# Altium schematic sheet power_POS5V.schdoc: POS5V.schdoc
size A4; Organization: Badgerloop; Address1: 133 Engineering Research; Address2: Building; Address3: Madison, WI 53715; DocumentNumber: 1; Revision: A; SheetNumber: 1; SheetTotal: 2
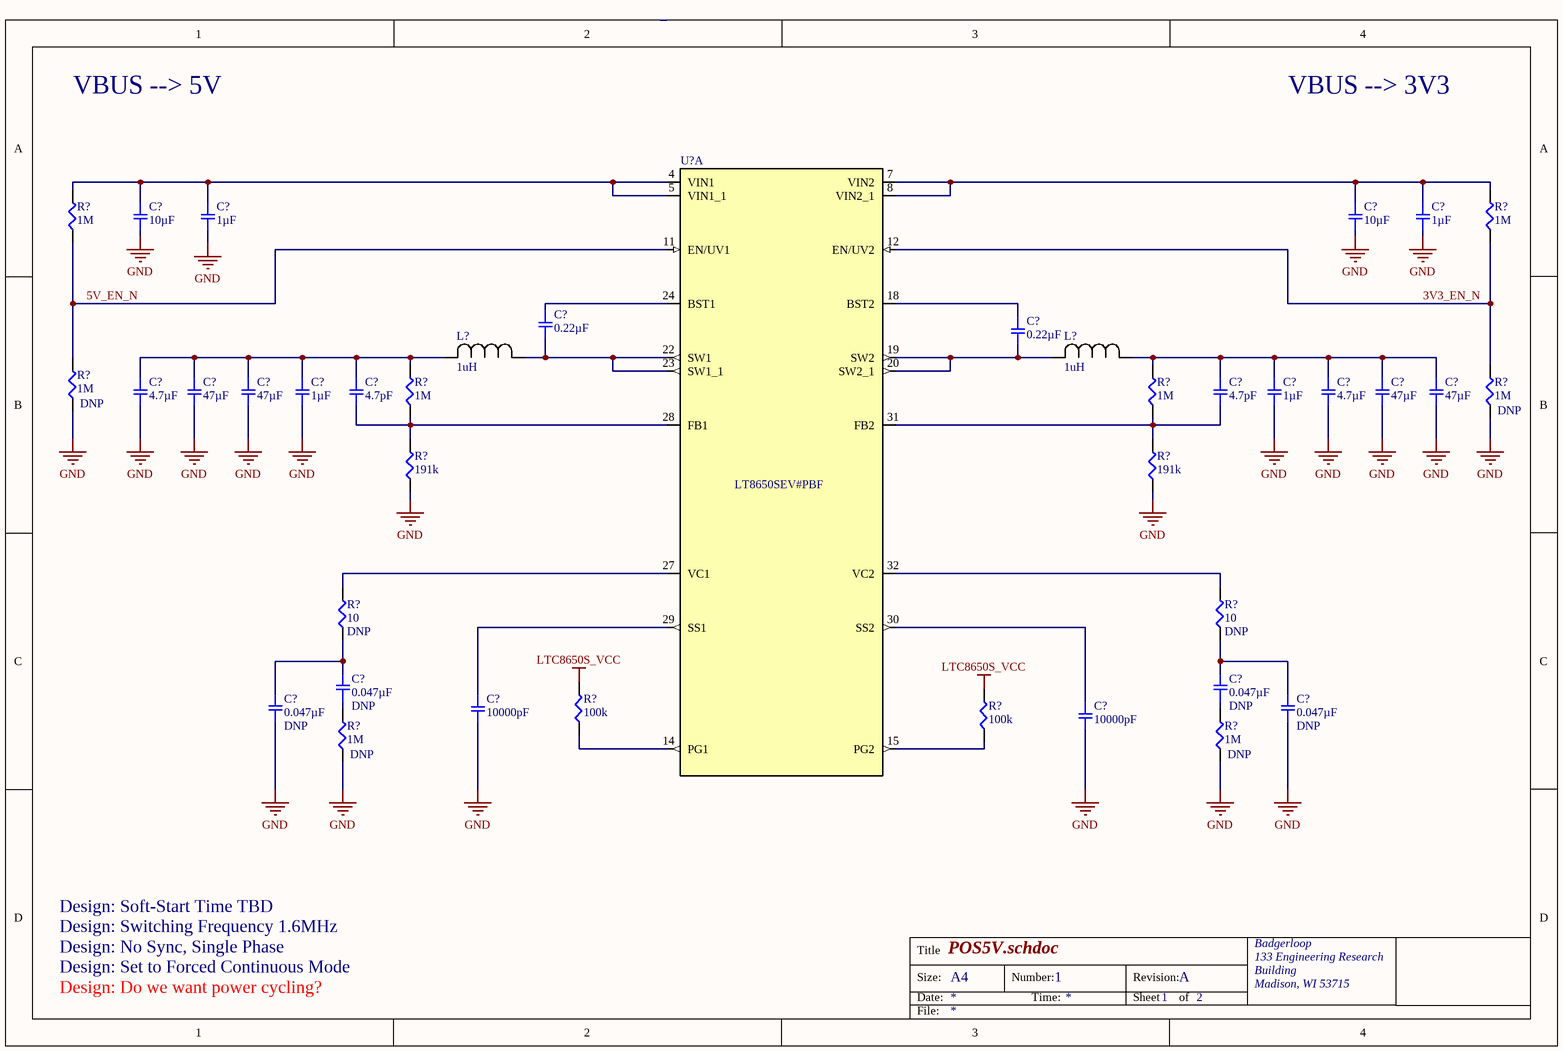
[diagram p0: power_POS5V.schdoc]

## Parts
(Parts that share a designator on the sheet are numbered #1, #2 ... from top to bottom, then left to right.)
C?#1  10µF  [SMD-1206C]
C?#2  1µF  [SMD-0805C]
C?#3  10µF  [SMD-1206C]
C?#4  1µF  [SMD-0805C]
C?#5  0.22µF  [SMD-0603C]
C?#6  0.22µF  [SMD-0603C]
C?#7  4.7µF  [SMD-0603C]
C?#8  47µF  [SMD-1206C]
C?#9  47µF  [SMD-1206C]
C?#10  1µF  [SMD-0603C]
C?#11  4.7pF  [SMD-0603C]
C?#12  4.7pF  [SMD-0603C]
C?#13  1µF  [SMD-0603C]
C?#14  4.7µF  [SMD-0603C]
C?#15  47µF  [SMD-1206C]
C?#16  47µF  [SMD-1206C]
C?#17  0.047µF  Do Not Populate: DNP  [SMD-0402C]
C?#18  0.047µF  Do Not Populate: DNP  [SMD-0402C]
C?#19  0.047µF  Do Not Populate: DNP  [SMD-0402C]
C?#20  10000pF  [SMD-0603C]
C?#21  0.047µF  Do Not Populate: DNP  [SMD-0402C]
C?#22  10000pF  [SMD-0603C]
L?#1  1uH  [IND_TAIYO_CBC201]
L?#2  1uH  [IND_TAIYO_CBC201]
R?#1  1M  [SMD-0402-RES]
R?#2  1M  [SMD-0402-RES]
R?#3  1M  Do Not Populate: DNP  [SMD-0402-RES]
R?#4  1M  [SMD-0402-RES]
R?#5  1M  [SMD-0402-RES]
R?#6  1M  Do Not Populate: DNP  [SMD-0402-RES]
R?#7  191k  [SMD-0402-RES]
R?#8  191k  [SMD-0402-RES]
R?#9  10  Do Not Populate: DNP  [SMD-0402-RES]
R?#10  10  Do Not Populate: DNP  [SMD-0402-RES]
R?#11  100k  [SMD-0402-RES]
R?#12  100k  [SMD-0402-RES]
R?#13  1M  Do Not Populate: DNP  [SMD-0402-RES]
R?#14  1M  Do Not Populate: DNP  [SMD-0402-RES]
U?  LT8650SEV#PBF  [QFN50P600X400X103-32N240X440]  (part A of 2)

## Nets
GND: C?#1.2 C?#2.2 C?#3.2 C?#4.2 C?#7.2 C?#8.2 C?#9.2 C?#10.2 C?#13.2 C?#14.2 C?#15.2 C?#16.2 C?#19.1 C?#20.2 C?#21.1 C?#22.2 R?#3.1 R?#6.1 R?#7.1 R?#8.1 R?#13.1 R?#14.1
LTC8650S_VCC: R?#11.2 R?#12.2
3V3_EN_N: R?#2.1 R?#6.2 U?.12(EN/UV2)
5V_EN_N: R?#1.1 R?#3.2 U?.11(EN/UV1)
NetC?#1_1: C?#1.1 C?#2.1 R?#1.2 U?.4(VIN1) U?.5(VIN1_1)
NetC?#3_1: C?#3.1 C?#4.1 R?#2.2 U?.7(VIN2) U?.8(VIN2_1)
NetC?#5_1: C?#5.1 U?.24(BST1)
NetC?#5_2: C?#5.2 L?#1.1 U?.22(SW1) U?.23(SW1_1)
NetC?#6_1: C?#6.1 U?.18(BST2)
NetC?#6_2: C?#6.2 L?#2.2 U?.19(SW2) U?.20(SW2_1)
NetC?#7_1: C?#7.1 C?#8.1 C?#9.1 C?#10.1 C?#11.1 L?#1.2 R?#4.2
NetC?#11_2: C?#11.2 R?#4.1 R?#7.2 U?.28(FB1)
NetC?#12_1: C?#12.1 C?#13.1 C?#14.1 C?#15.1 C?#16.1 L?#2.1 R?#5.2
NetC?#12_2: C?#12.2 R?#5.1 R?#8.2 U?.31(FB2)
NetC?#17_1: C?#17.1 R?#13.2
NetC?#17_2: C?#17.2 C?#19.2 R?#9.1
NetC?#18_1: C?#18.1 R?#14.2
NetC?#18_2: C?#18.2 C?#21.2 R?#10.1
NetC?#20_1: C?#20.1 U?.29(SS1)
NetC?#22_1: C?#22.1 U?.30(SS2)
NetR?#9_2: R?#9.2 U?.27(VC1)
NetR?#10_2: R?#10.2 U?.32(VC2)
NetR?#11_1: R?#11.1 U?.14(PG1)
NetR?#12_1: R?#12.1 U?.15(PG2)

## Notes on the sheet
- VBUS --> 5V
- VBUS --> 3V3
- Design: Soft-Start Time TBD
- Design: Switching Frequency 1.6MHz
- Design: No Sync, Single Phase
- Design: Set to Forced Continuous Mode
- Design: Do we want power cycling?
- Title
- Size:
- Date:
- A4
- Number:
- Time:
- Revision:
- Sheet
- of
- File:

## Library data of the parts
C?#1 C?#3 = GRM31CR61H106KA12L: CAP CER 10UF 50V X5R 1206; Manufacturer: Murata Electronics North America; Factory Stock: 0; Unit Price (USD): 0.65; Minimum Quantity: 1; Tolerance: ±10%; Datasheets: http://www.murata.com/~/media/webrenewal/support/library/catalog/products/capacitor/mlcc/c02e.pdf; Image: //media.digikey.com/Renders/Murata%20Renders/GR331BD72E473KW01L.jpg; Digi-Key Part Number: 490-5961-1-ND; Part Number: GRM31CR61H106KA12L; Quantity Available: 86736; @ qty: 0; Packaging: Cut Tape (CT); Series: GRM; Part Status: Active; Value: 10µF; Voltage: 50V; Temperature Coefficient: X5R; Operating Temperature: -55°C ~ 85°C; Features: -; Ratings: -; Applications: General Purpose; Mounting Type: Surface Mount, MLCC; Package / Case: 1206 (3216 Metric); Size / Dimension: 0.126" L x 0.063" W (3.20mm x 1.60mm); Height - Seated (Max): -; Thickness (Max): 0.071" (1.80mm); Lead Spacing: -; Lead Style: -
C?#2 C?#4 = GCJ21BR71H105KA01L: CAP CER 1UF 50V X7R 0805; Manufacturer: Murata Electronics North America; Factory Stock: 0; Unit Price (USD): 0.33; Minimum Quantity: 1; Tolerance: ±10%; Datasheets: http://www.murata.com/~/media/webrenewal/support/library/catalog/products/capacitor/mlcc/c03e.ashx; Image: //media.digikey.com/Renders/Murata%20Renders/0805%20(2012%20Metric)%20.85mm.jpg; Digi-Key Part Number: 490-10667-1-ND; Part Number: GCJ21BR71H105KA01L; Quantity Available: 55137; @ qty: 0; Packaging: Cut Tape (CT); Series: GCJ; Part Status: Active; Value: 1µF; Voltage: 50V; Temperature Coefficient: X7R; Operating Temperature: -55°C ~ 125°C; Features: Soft Termination; Ratings: AEC-Q200; Applications: Automotive, Boardflex Sensitive; Mounting Type: Surface Mount, MLCC; Package / Case: 0805 (2012 Metric); Size / Dimension: 0.079" L x 0.049" W (2.00mm x 1.25mm); Height - Seated (Max): -; Thickness (Max): 0.057" (1.45mm); Lead Spacing: -; Lead Style: -
C?#5 C?#6 = GCJ188R71E224KA12D: CAP CER 0.22UF 25V X7R 0603; Manufacturer: Murata Electronics North America; Factory Stock: 0; Unit Price (USD): 0.24; Minimum Quantity: 1; Tolerance: ±10%; Datasheets: http://www.murata.com/~/media/webrenewal/support/library/catalog/products/capacitor/mlcc/c03e.ashx; Image: //media.digikey.com/Renders/Murata%20Renders/0603%28LQG18%29.jpg; Digi-Key Part Number: 490-5797-1-ND; Part Number: GCJ188R71E224KA12D; Quantity Available: 23903; @ qty: 0; Packaging: Cut Tape (CT); Series: GCJ; Part Status: Active; Value: 0.22µF; Voltage: 25V; Temperature Coefficient: X7R; Operating Temperature: -55°C ~ 125°C; Features: Soft Termination; Ratings: AEC-Q200; Applications: Automotive, Boardflex Sensitive; Mounting Type: Surface Mount, MLCC; Package / Case: 0603 (1608 Metric); Size / Dimension: 0.063" L x 0.031" W (1.60mm x 0.80mm); Height - Seated (Max): -; Thickness (Max): 0.035" (0.90mm); Lead Spacing: -; Lead Style: -
C?#7 C?#14 = GRM188R61E475KE11D: CAP CER 4.7UF 25V X5R 0603; Manufacturer: Murata Electronics North America; Factory Stock: 0; Unit Price (USD): 0.32; Minimum Quantity: 1; Tolerance: ±10%; Datasheets: http://www.murata.com/~/media/webrenewal/support/library/catalog/products/capacitor/mlcc/c02e.pdf; Image: //media.digikey.com/Renders/Murata%20Renders/ZRB-SERIES-0402.jpg; Digi-Key Part Number: 490-7203-1-ND; Part Number: GRM188R61E475KE11D; Quantity Available: 150881; @ qty: 0; Packaging: Cut Tape (CT); Series: GRM; Part Status: Active; Value: 4.7µF; Voltage: 25V; Temperature Coefficient: X5R; Operating Temperature: -55°C ~ 85°C; Features: -; Ratings: -; Applications: General Purpose; Mounting Type: Surface Mount, MLCC; Package / Case: 0603 (1608 Metric); Size / Dimension: 0.063" L x 0.031" W (1.60mm x 0.80mm); Height - Seated (Max): -; Thickness (Max): 0.031" (0.80mm); Lead Spacing: -; Lead Style: -
C?#8 C?#9 C?#15 C?#16 = GRM31CR61A476ME15L: CAP CER 47UF 10V X5R 1206; Manufacturer: Murata Electronics North America; Factory Stock: 0; Unit Price (USD): 0.64; Minimum Quantity: 1; Tolerance: ±20%; Datasheets: http://www.murata.com/~/media/webrenewal/support/library/catalog/products/capacitor/mlcc/c02e.pdf; Image: //media.digikey.com/Renders/Murata%20Renders/GR331BD72E473KW01L.jpg; Digi-Key Part Number: 490-5528-1-ND; Part Number: GRM31CR61A476ME15L; Quantity Available: 151940; @ qty: 0; Packaging: Cut Tape (CT); Series: GRM; Part Status: Active; Value: 47µF; Voltage: 10V; Temperature Coefficient: X5R; Operating Temperature: -55°C ~ 85°C; Features: -; Ratings: -; Applications: General Purpose; Mounting Type: Surface Mount, MLCC; Package / Case: 1206 (3216 Metric); Size / Dimension: 0.126" L x 0.063" W (3.20mm x 1.60mm); Height - Seated (Max): -; Thickness (Max): 0.071" (1.80mm); Lead Spacing: -; Lead Style: -
C?#10 C?#13 = GRM188R61H105KAALD: CAP CER 1UF 50V X5R 0603; Manufacturer: Murata Electronics North America; Factory Stock: 0; Unit Price (USD): 0.17; Minimum Quantity: 1; Tolerance: ±10%; Datasheets: http://www.murata.com/~/media/webrenewal/support/library/catalog/products/capacitor/mlcc/c02e.pdf; Image: //media.digikey.com/Renders/Murata%20Renders/ZRB-SERIES-0402.jpg; Digi-Key Part Number: 490-10732-1-ND; Part Number: GRM188R61H105KAALD; Quantity Available: 46576; @ qty: 0; Packaging: Cut Tape (CT); Series: GRM; Part Status: Active; Value: 1µF; Voltage: 50V; Temperature Coefficient: X5R; Operating Temperature: -55°C ~ 85°C; Features: -; Ratings: -; Applications: General Purpose; Mounting Type: Surface Mount, MLCC; Package / Case: 0603 (1608 Metric); Size / Dimension: 0.063" L x 0.031" W (1.60mm x 0.80mm); Height - Seated (Max): -; Thickness (Max): 0.035" (0.90mm); Lead Spacing: -; Lead Style: -
C?#11 C?#12 = GRM1885C1H4R7CA01D: CAP CER 4.7PF 50V NP0 0603; Manufacturer: Murata Electronics North America; Factory Stock: 0; Unit Price (USD): 0.1; Minimum Quantity: 1; Tolerance: ±0.25pF; Temperature Coefficient: C0G, NP0; Datasheets: http://www.murata.com/~/media/webrenewal/support/library/catalog/products/capacitor/mlcc/c02e.pdf; Image: //media.digikey.com/Renders/Murata%20Renders/ZRB-SERIES-0402.jpg; Digi-Key Part Number: 490-12722-1-ND; Part Number: GRM1885C1H4R7CA01D; Quantity Available: 25832; @ qty: 0; Packaging: Cut Tape (CT); Series: GRM; Part Status: Active; Value: 4.7pF; Voltage: 50V; Operating Temperature: -55°C ~ 125°C; Features: -; Ratings: -; Applications: General Purpose; Mounting Type: Surface Mount, MLCC; Package / Case: 0603 (1608 Metric); Size / Dimension: 0.063" L x 0.031" W (1.60mm x 0.80mm); Height - Seated (Max): -; Thickness (Max): 0.035" (0.90mm); Lead Spacing: -; Lead Style: -
C?#17-C?#19 C?#21 = GCM155R71C473KA37D: CAP CER 0.047UF 16V X7R 0402; Manufacturer: Murata Electronics North America; Factory Stock: 0; Unit Price (USD): 0.1; Minimum Quantity: 1; Tolerance: ±10%; Datasheets: http://www.murata.com/~/media/webrenewal/support/library/catalog/products/capacitor/mlcc/c03e.ashx; Image: //media.digikey.com/Renders/Murata%20Renders/ZRB-SERIES-0402.jpg; Digi-Key Part Number: 490-6042-1-ND; Part Number: GCM155R71C473KA37D; Quantity Available: 86052; @ qty: 0; Packaging: Cut Tape (CT); Series: GCM; Part Status: Active; Value: 0.047µF; Voltage: 16V; Temperature Coefficient: X7R; Operating Temperature: -55°C ~ 125°C; Features: -; Ratings: AEC-Q200; Applications: Automotive; Mounting Type: Surface Mount, MLCC; Package / Case: 0402 (1005 Metric); Size / Dimension: 0.039" L x 0.020" W (1.00mm x 0.50mm); Height - Seated (Max): -; Thickness (Max): 0.022" (0.55mm); Lead Spacing: -; Lead Style: -
C?#20 C?#22 = GRM188R71E103KA01D: CAP CER 10000PF 25V X7R 0603; Manufacturer: Murata Electronics North America; Factory Stock: 0; Unit Price (USD): 0.1; Minimum Quantity: 1; Tolerance: ±10%; Datasheets: http://www.murata.com/~/media/webrenewal/support/library/catalog/products/capacitor/mlcc/c02e.pdf; Image: //media.digikey.com/Renders/Murata%20Renders/ZRB-SERIES-0402.jpg; Digi-Key Part Number: 490-1520-1-ND; Part Number: GRM188R71E103KA01D; Quantity Available: 886950; @ qty: 0; Packaging: Cut Tape (CT); Series: GRM; Part Status: Active; Value: 10000pF; Voltage: 25V; Temperature Coefficient: X7R; Operating Temperature: -55°C ~ 125°C; Features: -; Ratings: -; Applications: General Purpose; Mounting Type: Surface Mount, MLCC; Package / Case: 0603 (1608 Metric); Size / Dimension: 0.063" L x 0.031" W (1.60mm x 0.80mm); Height - Seated (Max): -; Thickness (Max): 0.035" (0.90mm); Lead Spacing: -; Lead Style: -
L?#1 L?#2 = IND 1.0uH 5.48x5.28x3.1mm 5mOhm ESR: XFL5030-102ME; Vendor: CoilCraft; Type: DEV; Value: 1.0uH; Tolerance: +-20%; Maximum DC Current: 28A; Qualification: AEC-Q200; Manufacturer_Part_Number: XFL5030-102ME; RefDes: RefDes; Do Not Populate: *; Temperature: -40C ~ 125C; Inductance: 1uH; Package / Case: 5.48mm x 5.28mm x 3.1mm; Height: 3.1mm; Link: https://www.mouser.com/ProductDetail/Coilcraft/XFL5030-102MEB?qs=sGAEpiMZZMsg%252by3WlYCkUy0Se8nYOmwuY%252bO5URw9yeY%3d; Datasheet: https://www.mouser.com/datasheet/2/597/xfl5030-1223909.pdf
R?#1-R?#6 R?#13 R?#14 = ERJ-2RKF1004X: RES SMD 1M OHM 1% 1/10W 0402; Manufacturer: Panasonic Electronic Components; Factory Stock: 0; Unit Price (USD): 0.00496; @ qty: 1500; Minimum Quantity: 1; Power (Watts): 0.1W, 1/10W; Temperature Coefficient: ±100ppm/°C; Part Number: ERJ-2RKF1004X; Datasheets: http://industrial.panasonic.com/www-cgi/jvcr13pz.cgi?E+PZ+3+AOA0002+ERJ2RKF1004X+7+WW; Image: //media.digikey.com/Photos/Panasonic%20Photos/ERJ-PA2-Series.jpg; Digi-Key Part Number: P1.00MLCT-ND; Quantity Available: 773705; Packaging: Cut Tape (CT); Series: ERJ; Part Status: Active; Value: 1M; Tolerance: ±1%; Composition: Thick Film; Features: Automotive AEC-Q200; Operating Temperature: -55°C ~ 155°C; Package / Case: 0402 (1005 Metric); Supplier Device Package: 0402; Size / Dimension: 0.039" L x 0.020" W (1.00mm x 0.50mm); Height - Seated (Max): 0.016" (0.40mm); Number of Terminations: 2; Failure Rate: -
R?#7 R?#8 = ERJ-2RKF1913X: RES SMD 191K OHM 1% 1/10W 0402; Manufacturer: Panasonic Electronic Components; Factory Stock: 0; Unit Price (USD): 0.00496; @ qty: 1500; Minimum Quantity: 1; Power (Watts): 0.1W, 1/10W; Temperature Coefficient: ±100ppm/°C; Part Number: ERJ-2RKF1913X; Datasheets: http://industrial.panasonic.com/www-cgi/jvcr13pz.cgi?E+PZ+3+AOA0002+ERJ2RKF1913X+7+WW; Image: //media.digikey.com/Photos/Panasonic%20Photos/ERJ-PA2-Series.jpg; Digi-Key Part Number: P191KLCT-ND; Quantity Available: 44522; Packaging: Cut Tape (CT); Series: ERJ; Part Status: Active; Value: 191k; Tolerance: ±1%; Composition: Thick Film; Features: Automotive AEC-Q200; Operating Temperature: -55°C ~ 155°C; Package / Case: 0402 (1005 Metric); Supplier Device Package: 0402; Size / Dimension: 0.039" L x 0.020" W (1.00mm x 0.50mm); Height - Seated (Max): 0.016" (0.40mm); Number of Terminations: 2; Failure Rate: -
R?#9 R?#10 = ERJ-2GEJ100X: RES SMD 10 OHM 5% 1/10W 0402; Manufacturer: Panasonic Electronic Components; Factory Stock: 0; Unit Price (USD): 0.00350; @ qty: 1500; Minimum Quantity: 1; Power (Watts): 0.1W, 1/10W; Temperature Coefficient: ±200ppm/°C; Part Number: ERJ-2GEJ100X; Datasheets: http://industrial.panasonic.com/www-cgi/jvcr13pz.cgi?E+PZ+3+AOA0001+ERJ2GEJ100X+7+WW; Image: //media.digikey.com/Photos/Panasonic%20Photos/ERJ-PA2-Series.jpg; Digi-Key Part Number: P10JCT-ND; Quantity Available: 1054751; Packaging: Cut Tape (CT); Series: ERJ; Part Status: Active; Value: 10; Tolerance: ±5%; Composition: Thick Film; Features: Automotive AEC-Q200; Operating Temperature: -55°C ~ 155°C; Package / Case: 0402 (1005 Metric); Supplier Device Package: 0402; Size / Dimension: 0.039" L x 0.020" W (1.00mm x 0.50mm); Height - Seated (Max): 0.016" (0.40mm); Number of Terminations: 2; Failure Rate: -
R?#11 R?#12 = ERJ-2GEJ104X: RES SMD 100K OHM 5% 1/10W 0402; Manufacturer: Panasonic Electronic Components; Factory Stock: 0; Unit Price (USD): 0.00350; @ qty: 1500; Minimum Quantity: 1; Power (Watts): 0.1W, 1/10W; Temperature Coefficient: ±200ppm/°C; Part Number: ERJ-2GEJ104X; Datasheets: http://industrial.panasonic.com/www-cgi/jvcr13pz.cgi?E+PZ+3+AOA0001+ERJ2GEJ104X+7+WW; Image: //media.digikey.com/Photos/Panasonic%20Photos/ERJ-PA2-Series.jpg; Digi-Key Part Number: P100KJCT-ND; Quantity Available: 2387986; Packaging: Cut Tape (CT); Series: ERJ; Part Status: Active; Value: 100k; Tolerance: ±5%; Composition: Thick Film; Features: Automotive AEC-Q200; Operating Temperature: -55°C ~ 155°C; Package / Case: 0402 (1005 Metric); Supplier Device Package: 0402; Size / Dimension: 0.039" L x 0.020" W (1.00mm x 0.50mm); Height - Seated (Max): 0.016" (0.40mm); Number of Terminations: 2; Failure Rate: -
U? = LT8650SEV#PBF: LT8650S - Dual Channel 4A, 42V, Synchronous Step-Down Silent Switcher 2 with 6.2ÂµA Quiescent Current; MF: Linear Technology; MP: LT8650SEV#PBF; SnapEDA_Link: https://www.snapeda.com/parts/LT8650SEV%23PBF/Linear%20Technology/Analog%20Devices/view-part/?ref=snap; Digi-Key_Part_Number: LT8650SEV#PBF-ND; Package: LQFN-32 Linear Technology; Digi-Key_Purchase_URL: https://www.digikey.com/product-detail/en/linear-technology-analog-devices/LT8650SEV-PBF/LT8650SEV-PBF-ND/7702365?utm_source=snapeda&utm_medium=aggregator&utm_campaign=symbol; Value: *